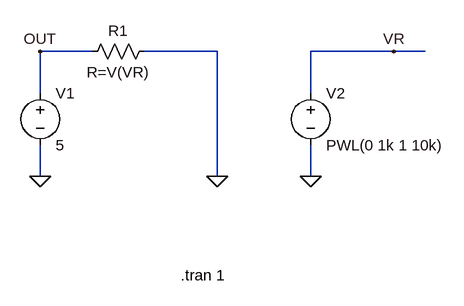
[diagram p0: schematic Draft1.asc]
Draft1.asc, the LTspice schematic file:
Version 4.1
SHEET 1 880 680
WIRE 176 48 96 48
WIRE 368 48 256 48
WIRE 640 48 512 48
WIRE 688 48 640 48
WIRE 96 112 96 48
WIRE 512 112 512 48
WIRE 96 240 96 192
WIRE 368 240 368 48
WIRE 512 240 512 192
FLAG 96 240 0
FLAG 512 240 0
FLAG 368 240 0
FLAG 640 48 VR
FLAG 96 48 OUT
SYMBOL voltage 96 96 R0
WINDOW 123 0 0 Left 0
WINDOW 39 0 0 Left 0
SYMATTR InstName V1
SYMATTR Value 5
SYMBOL voltage 512 96 R0
WINDOW 123 0 0 Left 0
WINDOW 39 0 0 Left 0
SYMATTR InstName V2
SYMATTR Value PWL(0 1k 1 10k)
SYMBOL res 272 32 R90
WINDOW 0 0 56 VBottom 2
WINDOW 3 32 56 VTop 2
SYMATTR InstName R1
SYMATTR Value R=V(VR)
TEXT 312 392 Left 2 !.tran 1

The netlist it stands for:
* Draft1.asc
V1 OUT 0 5
V2 VR 0 PWL(0 1k 1 10k)
R1 0 OUT R=V(VR)
.tran 1
.backanno
.end